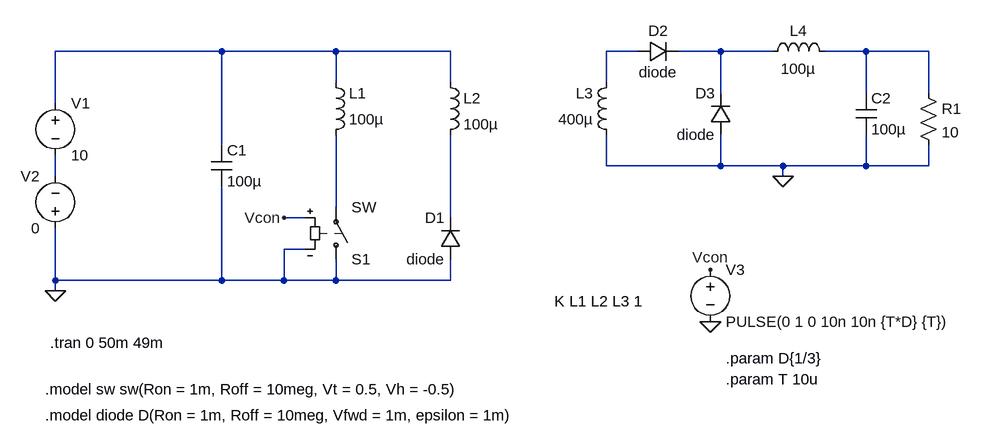
[diagram p0: schematic forward_converter_ideal.asc]
forward_converter_ideal.asc, the LTspice schematic file:
Version 4.1
SHEET 1 1504 680
WIRE 336 16 80 16
WIRE 512 16 336 16
WIRE 688 16 512 16
WIRE 976 16 928 16
WIRE 1104 16 1040 16
WIRE 1184 16 1104 16
WIRE 1328 16 1264 16
WIRE 1424 16 1328 16
WIRE 512 64 512 16
WIRE 688 64 688 16
WIRE 928 64 928 16
WIRE 1104 80 1104 16
WIRE 1328 80 1328 16
WIRE 1424 80 1424 16
WIRE 80 96 80 16
WIRE 336 160 336 16
WIRE 928 192 928 144
WIRE 1104 192 1104 144
WIRE 1104 192 928 192
WIRE 1200 192 1104 192
WIRE 1328 192 1328 144
WIRE 1328 192 1200 192
WIRE 1424 192 1424 160
WIRE 1424 192 1328 192
WIRE 80 208 80 176
WIRE 1200 208 1200 192
WIRE 512 256 512 144
WIRE 464 272 432 272
WIRE 688 272 688 144
WIRE 464 320 432 320
WIRE 80 368 80 288
WIRE 336 368 336 224
WIRE 336 368 80 368
WIRE 432 368 432 320
WIRE 432 368 336 368
WIRE 512 368 512 336
WIRE 512 368 432 368
WIRE 688 368 688 336
WIRE 688 368 512 368
WIRE 80 384 80 368
FLAG 80 384 0
FLAG 1088 432 0
FLAG 1088 352 Vcon
FLAG 432 272 Vcon
FLAG 1200 208 0
SYMBOL voltage 80 80 R0
WINDOW 123 0 0 Left 0
WINDOW 39 0 0 Left 0
SYMATTR InstName V1
SYMATTR Value 10
SYMBOL voltage 80 304 R180
WINDOW 0 24 96 Left 2
WINDOW 3 24 16 Left 2
WINDOW 123 0 0 Left 0
WINDOW 39 0 0 Left 0
SYMATTR InstName V2
SYMATTR Value 0
SYMBOL cap 320 160 R0
SYMATTR InstName C1
SYMATTR Value 100µ
SYMBOL sw 512 352 M180
SYMATTR InstName S1
SYMBOL ind 496 160 M180
WINDOW 0 36 80 Left 2
WINDOW 3 36 40 Left 2
SYMATTR InstName L1
SYMATTR Value 100µ
SYMATTR Type ind
SYMBOL diode 704 336 R180
WINDOW 0 24 64 Left 2
WINDOW 3 24 0 Left 2
SYMATTR InstName D1
SYMATTR Value diode
SYMBOL ind 672 48 R0
SYMATTR InstName L2
SYMATTR Value 100µ
SYMATTR Type ind
SYMBOL ind 944 160 R180
WINDOW 0 36 80 Left 2
WINDOW 3 36 40 Left 2
SYMATTR InstName L3
SYMATTR Value 400µ
SYMATTR Type ind
SYMBOL diode 976 32 R270
WINDOW 0 32 32 VTop 2
WINDOW 3 0 32 VBottom 2
SYMATTR InstName D2
SYMATTR Value diode
SYMBOL diode 1120 144 R180
WINDOW 0 24 64 Left 2
WINDOW 3 24 0 Left 2
SYMATTR InstName D3
SYMATTR Value diode
SYMBOL ind 1168 32 R270
WINDOW 0 32 56 VTop 2
WINDOW 3 5 56 VBottom 2
SYMATTR InstName L4
SYMATTR Value 100µ
SYMBOL cap 1312 80 R0
SYMATTR InstName C2
SYMATTR Value 100µ
SYMBOL res 1408 64 R0
SYMATTR InstName R1
SYMATTR Value 10
SYMBOL voltage 1088 336 R0
WINDOW 123 0 0 Left 0
WINDOW 39 0 0 Left 0
SYMATTR InstName V3
SYMATTR Value PULSE(0 1 0 10n 10n {T*D} {T})
TEXT 848 400 Left 2 !K L1 L2 L3 1
TEXT 64 536 Left 2 !.model sw sw(Ron = 1m, Roff = 10meg, Vt = 0.5, Vh = -0.5)
TEXT 64 576 Left 2 !.model diode D(Ron = 1m, Roff = 10meg, Vfwd = 1m, epsilon = 1m)
TEXT 1112 488 Left 2 !.param D{1/3}
TEXT 1112 520 Left 2 !.param T 10u
TEXT 72 464 Left 2 !.tran 0 50m 49m

The netlist it stands for:
* forward_converter_ideal.asc
V1 N001 N005 10
V2 0 N005 0
C1 N001 0 100µ
S1 0 N006 Vcon 0 SW
L1 N006 N001 100µ
D1 0 N007 diode
L2 N001 N007 100µ
L3 0 N002 400µ
D2 N002 N003 diode
D3 0 N003 diode
L4 N003 N004 100µ
C2 N004 0 100µ
R1 N004 0 10
V3 Vcon 0 PULSE(0 1 0 10n 10n {T*D} {T})
.model D D
.lib standard.dio
K L1 L2 L3 1
.model sw sw(Ron = 1m, Roff = 10meg, Vt = 0.5, Vh = -0.5)
.model diode D(Ron = 1m, Roff = 10meg, Vfwd = 1m, epsilon = 1m)
.param D{1/3}
.param T 10u
.tran 0 50m 49m
.backanno
.end